# EAGLE design PCB_LT1711_LT1713 (EAGLE 9.1.2)
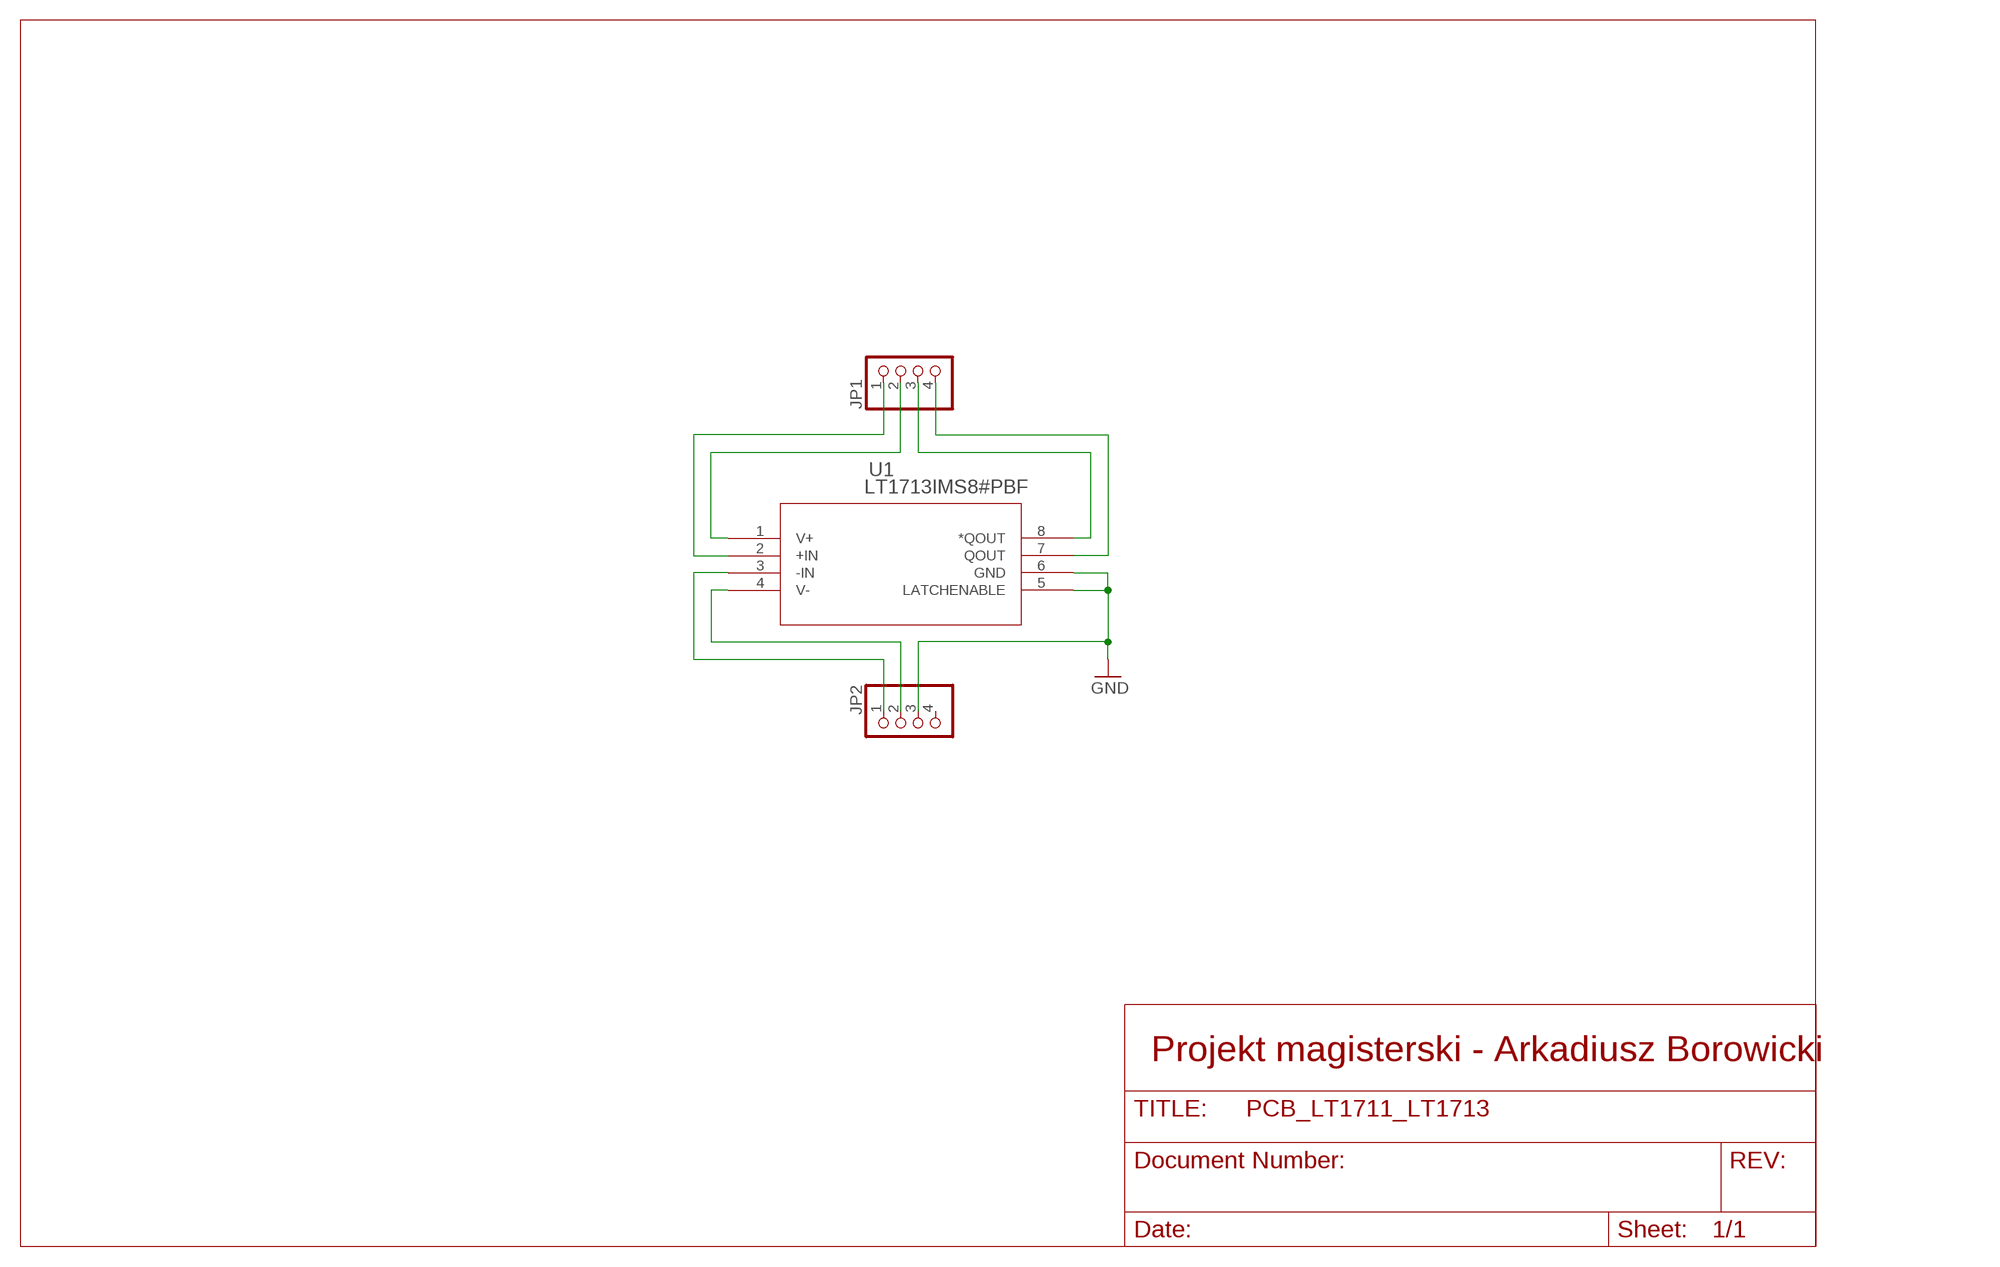
[diagram p0: schematic, sheet 1]

## Parts
JP1  PINHD-1X4  [1X04]
JP2  PINHD-1X4  [1X04]
U1  LT1713IMS8#PBF  [MSOP-8_MS]

## Nets
GND: JP2.3 U1.5(LATCHENABLE) U1.6(GND)
N$1: JP1.2 U1.1(V+)
N$2: JP1.1 U1.2(+IN)
N$3: JP2.1 U1.3(-IN)
N$4: JP2.2 U1.4(V-)
N$5: JP1.3 U1.8(*QOUT)
N$6: JP1.4 U1.7(QOUT)
Unconnected: JP2.4

## Notes on the sheet
- Projekt magisterski - Arkadiusz Borowicki

## Library data of the parts
JP1 JP2 = pinhead:PINHD-1X4: PIN HEADER
U1 = LT1713IMS8_PBF:LT1713IMS8#PBF: Check availability <https://pricing.snapeda.com/parts/LT1713IMS8%23PBF/Analog%20Devices/view-part?ref=eda>; AVAILABILITY: In Stock; CHECK_PRICES: https://www.snapeda.com/parts/LT1713IMS8%23PBF/Analog+Devices/view-part/?ref=eda; DESCRIPTION: Linear IC - Comparator Linear Technology LT1713IMS8#PBF + lock CMOS, Complementary, Rail-to-rail, TTL MSOP 8; MF: Analog Devices; MP: LT1713IMS8#PBF; PACKAGE: MSOP-8 Linear Technology; PRICE: None; PURCHASE-URL: https://www.snapeda.com/api/url_track_click_mouser/?unipart_id=601002&manufacturer=Analog Devices&part_name=LT1713IMS8#PBF&search_term=None; SNAPEDA_LINK: https://www.snapeda.com/parts/LT1713IMS8%23PBF/Analog+Devices/view-part/?ref=snap

## Board
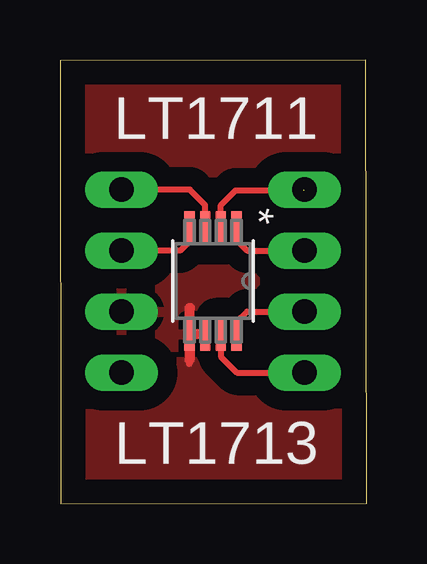
[diagram p1: board, top side]
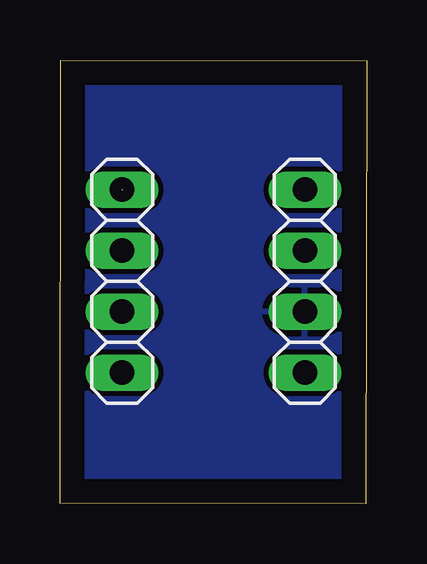
[diagram p2: board, bottom side, seen from below]

Size 12.77 x 18.48 mm. Coordinates in mm from the lower left corner, seen from the top.
Outline: 0.03,0 12.77,0.03 12.75,18.48 0,18.46 0.03,0
Copper layers (1*16): Top 0.035mm / dielectric 1.5mm / Bottom 0.035mm
Design rules "default *": minimum track width 10mil, minimum drill 20mil, track to track 8mil, track to pad 8mil, pad to pad 8mil, via to via 8mil, smd to smd 8mil, copper to edge 40mil, drill to drill 8mil, minimum pad ring 10mil, minimum via ring 8mil, stop-mask expansion 4mil, vias tented up to drill 25mil, thermal gap 10mil

### Footprints (pad centres in the part's own frame; a part is rotated, then mirrored left to right if it is on the bottom)
1X04 = drill 1.016 long: 1 -3.81,0; 2 -1.27,0; 3 1.27,0; 4 3.81,0
MSOP-8_MS = smd 1.397 x 0.432: 1 -2.21,0.975; 2 -2.21,0.325; 3 -2.21,-0.325; 4 -2.21,-0.975; 5 2.21,-0.975; 6 2.21,-0.325; 7 2.21,0.325; 8 2.21,0.975

### Placement (x,y rotation side)
JP1  10.19,9.27 270 bottom
JP2  2.57,9.27 270 bottom
U1  6.38,9.27 270 top

### Tracks (layer width: path | path; a pad name or v marks a point on that pad's centre or on a via)
GND
  Top 0.254: 5.4,7.58 U1.5 | 5.4,5.99 5.4,5.83 5.38,5.82
  Top 0.406: U1.6 U1.5 | U1.5 5.4,5.99 | U1.5 5.4,8.14 5.41,8.15
  pour Top (isolate 0.813): 0.05,18.67 13.16,18.67 13.16,-0.23 0.05,-0.23 0,18.67
  pour Bottom: -0.1,18.72 13.08,18.72 13.13,18.67 13.13,-0.2 0.05,-0.2 -0.08,-0.2 -0.08,18.69
N$1
  Top 0.254: 7.35,11.72 U1.1 7.35,10.99 7.8,10.54 JP1.2
N$2  (1 unrouted)
  Top 0.254: 10.16,13.06 7.32,13.06 6.7,12.44 U1.2
N$3
  Top 0.254: U1.3 6.05,12.44 5.41,13.08 JP2.1
N$4
  Top 0.254: U1.4 5.49,11.39 5.49,11.02 5,10.54 JP2.2
N$5
  Top 0.254: U1.8 7.35,7.55 7.8,8 JP1.3
N$6
  Top 0.254: U1.7 6.7,6.13 7.37,5.46 JP1.4

### Text on the board
tNames: LT1711 | LT1713